# EAGLE design SuniderPra (EAGLE 9.5.2)
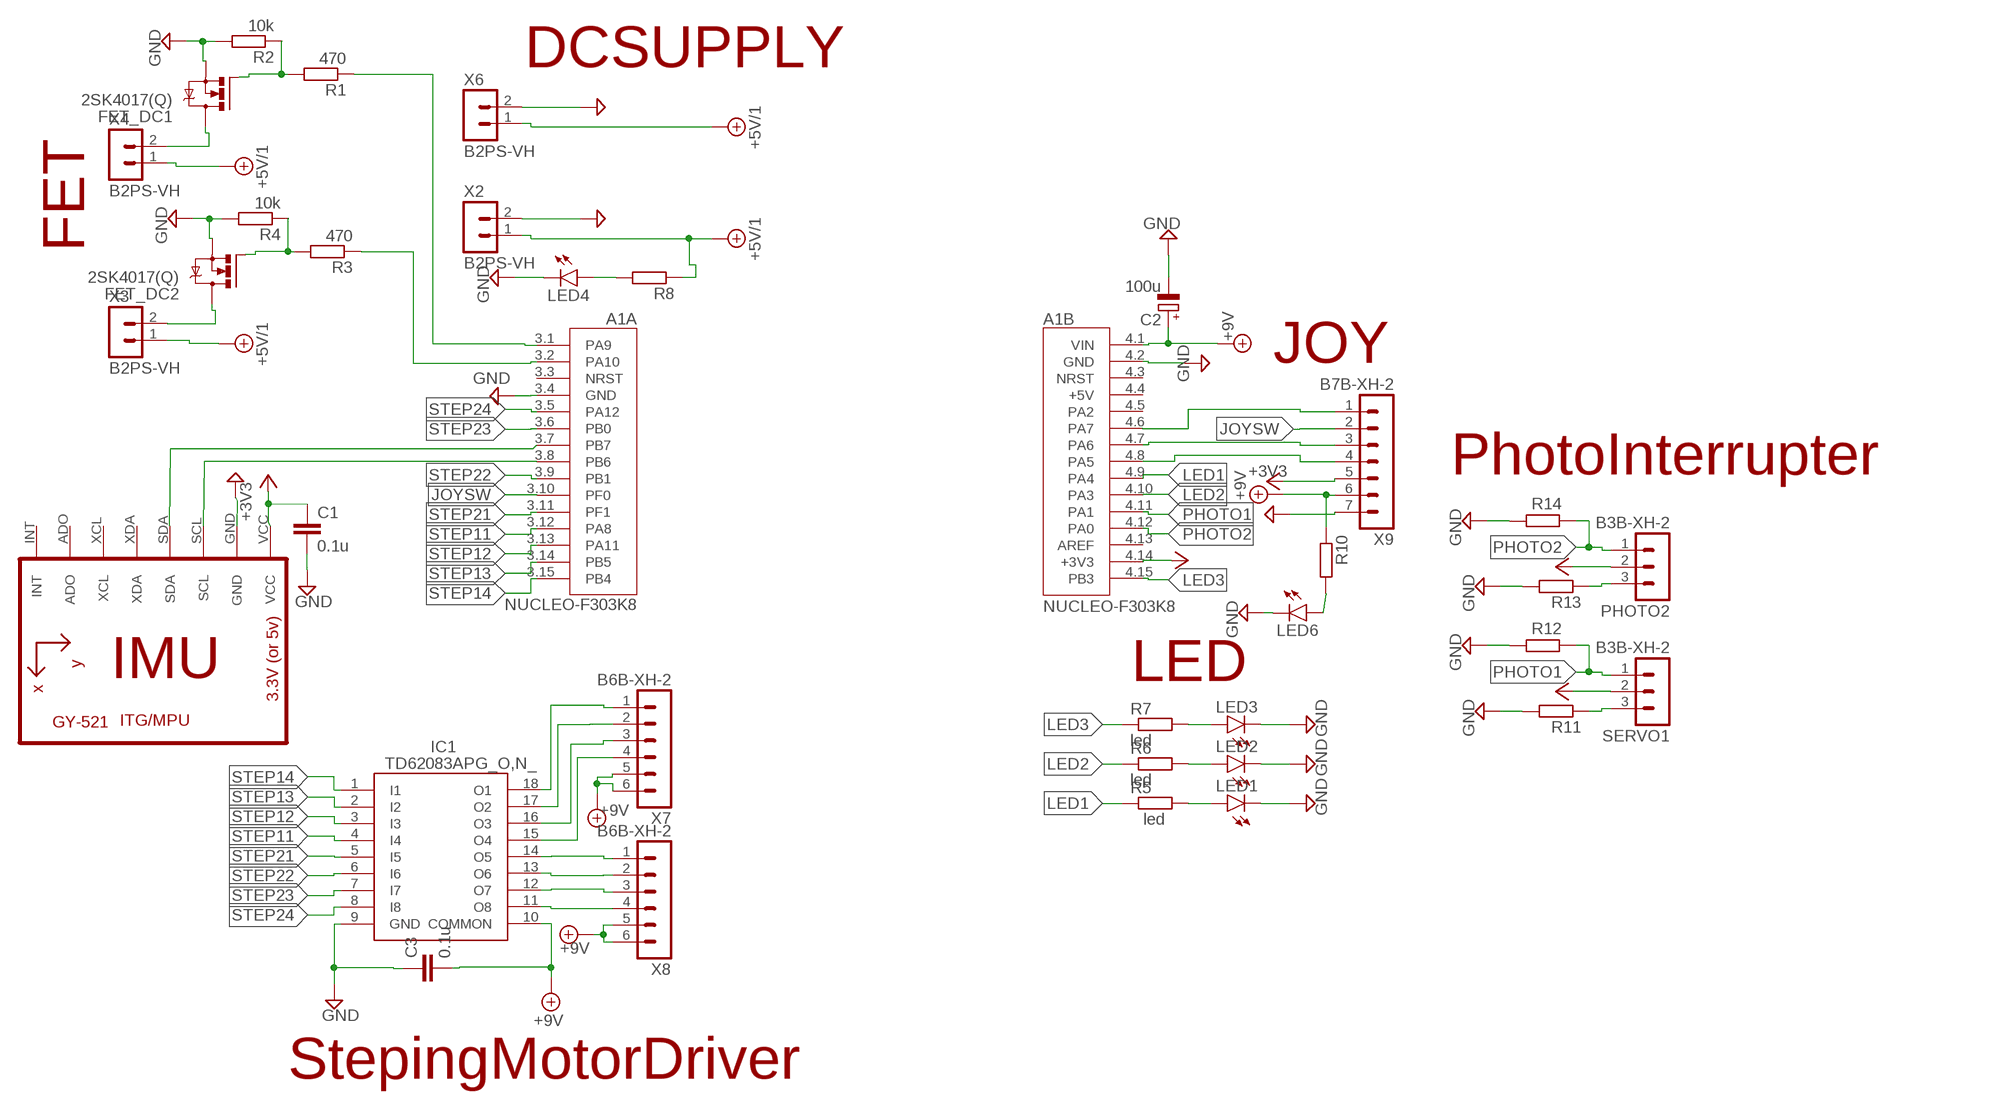
[diagram p0: schematic, sheet 1]

## Parts
A1  NUCLEO-F303K8  [MODULE_NUCLEO-F303K8]
C1  0.1u  C-EU050-024X044  [C050-024X044]
C2  100u  CPOL-EUE2,5-6E  [E2,5-6E]
C3  0.1u  C-EU050-024X044  [C050-024X044]
FET_DC1  2SK4017(Q)  [TO230P230X650X740-3P]
FET_DC2  2SK4017(Q)  [TO230P230X650X740-3P]
IC1  TD62083APG_O,N_  [DIP762W60P254L2510H445Q18N]
IMU  GY-521MPU6050  [GY-521]
LED1  LED3MM  [LED3MM]
LED2  LED3MM  [LED3MM]
LED3  LED3MM  [LED3MM]
LED4  LED3MM  [LED3MM]
LED6  LED3MM  [LED3MM]
PHOTO2  B3B-XH-2  [B3B-XH-A]
R1  470  R-EU_0207/7  [0207/7]
R2  10k  R-EU_0207/7  [0207/7]
R3  470  R-EU_0207/7  [0207/7]
R4  10k  R-EU_0207/7  [0207/7]
R5  led  R-EU_0207/7  [0207/7]
R6  led  R-EU_0207/7  [0207/7]
R7  led  R-EU_0207/7  [0207/7]
R8  led  R-EU_0207/7  [0207/7]
R10  led  R-EU_0207/7  [0207/7]
R11  220  R-EU_0207/7  [0207/7]
R12  10k  R-EU_0207/7  [0207/7]
R13  220  R-EU_0207/7  [0207/7]
R14  10k  R-EU_0207/7  [0207/7]
SERVO1  B3B-XH-2  [B3B-XH-A]
X2  B2PS-VH  [B2PS-VH]
X3  B2PS-VH  [B2PS-VH]
X4  B2PS-VH  [B2PS-VH]
X6  B2PS-VH  [B2PS-VH]
X7  B6B-XH-2  [B6B-XH-A]
X8  B6B-XH-2  [B6B-XH-A]
X9  B7B-XH-2  [B7B-XH-A]

## Nets
+3V3: A1.4.14(B:+3V3) C1.1 IMU.VCC PHOTO2.2 SERVO1.2 X9.5
+5V/1: R8.1 X2.1 X3.1 X4.1 X6.1
+9V: A1.4.1(B:VIN) C2.+ C3.2 IC1.10(COMMON) R10.1 X7.5 X7.6 X8.5 X8.6 X9.6
GND: A1.3.4(A:GND) A1.4.2(B:GND) C1.2 C2.- C3.1 FET_DC1.3(S) FET_DC2.3(S) IC1.9(GND) IMU.GND LED1.K(C) LED2.K(C) LED3.K(C) LED4.K(C) LED6.K(C) R2.2 R4.2 R11.2 R12.2 R13.2 R14.2 X2.2 X6.2 X9.7
JOYSW: A1.3.10(A:PF0) X9.2
LED1: A1.4.9(B:PA4) R5.1
LED2: A1.4.10(B:PA3) R6.1
LED3: A1.4.15(B:PB3) R7.1
N$1: A1.3.8(A:PB6) IMU.SCL
N$2: A1.3.7(A:PB7) IMU.SDA
N$3: IC1.18(O1) X7.1
N$4: IC1.12(O7) X8.3
N$5: A1.4.8(B:PA5) X9.4
N$6: FET_DC1.1(G) R1.2 R2.1
N$7: FET_DC2.2(D) X3.2
N$8: A1.3.2(A:PA10) R3.1
N$9: FET_DC2.1(G) R3.2 R4.1
N$10: FET_DC1.2(D) X4.2
N$11: LED2.A R6.2
N$12: IC1.13(O6) X8.2
N$13: A1.3.1(A:PA9) R1.1
N$14: LED1.A R5.2
N$15: LED3.A R7.2
N$16: IC1.14(O5) X8.1
N$17: IC1.15(O4) X7.4
N$18: A1.4.6(B:PA7) X9.1
N$19: A1.4.7(B:PA6) X9.3
N$21: LED4.A R8.2
N$22: IC1.16(O3) X7.3
N$23: IC1.17(O2) X7.2
N$25: LED6.A R10.2
N$26: PHOTO2.3 R13.1
N$27: R11.1 SERVO1.3
N$28: IC1.11(O8) X8.4
PHOTO1: A1.4.11(B:PA1) R12.1 SERVO1.1
PHOTO2: A1.4.12(B:PA0) PHOTO2.1 R14.1
STEP11: A1.3.12(A:PA8) IC1.4(I4)
STEP12: A1.3.13(A:PA11) IC1.3(I3)
STEP13: A1.3.14(A:PB5) IC1.2(I2)
STEP14: A1.3.15(A:PB4) IC1.1(I1)
STEP21: A1.3.11(A:PF1) IC1.5(I5)
STEP22: A1.3.9(A:PB1) IC1.6(I6)
STEP23: A1.3.6(A:PB0) IC1.7(I7)
STEP24: A1.3.5(A:PA12) IC1.8(I8)
Unconnected: A1.3.3(A:NRST) A1.4.3(B:NRST) A1.4.4(B:+5V) A1.4.5(B:PA2) A1.4.13(B:AREF) IMU.ADO IMU.INT IMU.XCL IMU.XDA

## Notes on the sheet
- DCSUPPLY
- FET
- JOY
- PhotoInterrupter
- LED
- IMU
- StepingMotorDriver

## Library data of the parts
A1 = NUCLEO-F303K8:NUCLEO-F303K8: STM32 Nucleo-32 development board with STM32F303K8T6 MCU, supports Arduino connectivity; AVAILABILITY: Unavailable; DESCRIPTION: STM32F303K8, mbed-Enabled Development Nucleo-32 STM32F3 ARM® Cortex®-M4 MCU 32-Bit Embedded Evaluation Board; MF: STMicroelectronics; MP: NUCLEO-F303K8; PACKAGE: None; PRICE: None
C1 C3 = rcl:C-EU: CAPACITOR, European symbol; SPICEPREFIX: C
C2 = rcl:CPOL-EU: POLARIZED CAPACITOR, European symbol; SPICEPREFIX: C
FET_DC1 FET_DC2 = 2SK4017_Q_:2SK4017(Q): Trans MOSFET N-CH 60V 5A 3-Pin(3+Tab) PW-Mold2 Check prices <https://pricing.snapeda.com/parts/2SK4017%28Q%29/Toshiba%20Semiconductor/view-part?ref=eda>; AVAILABILITY: Bad; DESCRIPTION: N-Channel 60V 5A (Ta) 20W (Tc) Through Hole PW-MOLD2; MF: Toshiba Semiconductor; MP: 2SK4017(Q); PACKAGE: TO-251 Toshiba; PRICE: None
IC1 = SamacSys_Parts:TD62083APG_O,N_: IC,Darlington,Sink,Driver,7ch,5V CMOS Toshiba TD62083APG(O,N) Octal NPN Darlington Transistor Array, 0.5 A 50 V HFE:1000, 18-Pin PDIP Source: Datasheet <http://docs-emea.rs-online.com/webdocs/12be/0900766b812bee23.pdf>; DESCRIPTION: IC,Darlington,Sink,Driver,7ch,5V CMOS Toshiba TD62083APG(O,N) Octal NPN Darlington Transistor Array, 0.5 A 50 V HFE:1000, 18-Pin PDIP; HEIGHT: 4.45mm; MANUFACTURER_NAME: Toshiba; MANUFACTURER_PART_NUMBER: TD62083APG(O,N); MOUSER_PART_NUMBER: 757-TD62083APGON; MOUSER_PRICE-STOCK: https://www.mouser.co.uk/ProductDetail/Toshiba/TD62083APGON?qs=tiksPeNXt0LYWQCl6bm%252B7w%3D%3D
IMU = MPU6050:GY-521
LED1-LED4 LED6 = led:LED: LED OSRAM: - CHIPLED LG R971, LG N971, LY N971, LG Q971, LY Q971, LO R971, LY R971 LH N974, LH R974 LS Q976, LO Q976, LY Q976 LO Q996 - Hyper CHIPLED LW Q18S LB Q993, LB Q99A, LB R99A - SideLED LS A670, LO A670, LY A670, LG A670, LP A670 LB A673, LV A673, LT A673, LW A673 LH A674 LY A675 LS A676, LA A676, LO A676, LY A676, LW A676 LS A679, LY A679, LG A679 - Hyper Micro SIDELED® LS Y876, LA Y876, LO Y876, LY Y876 LT Y87S - SmartLED LW L88C, LW L88S LB L89C, LB L89S, LG L890 LS L89K, LO L89K, LY L89K LS L896, LA L896, LO L896, LY L896 - TOPLED LS T670, LO T670, LY T670, LG T670, LP T670 LSG T670, LSP T670, LSY T670, LOP T670, LYG T670 LG T671, LOG T671, LSG T671 LB T673, LV T673, LT T673, LW T673 LH T674 LS T676, LA T676, LO T676, LY T676, LB T676, LH T676, LSB T676, LW T676 LB T67C, LV T67C, LT T67C, LS T67K, LO T67K, LY T67K, LW E67C LS E67B, LA E67B, LO E67B, LY E67B, LB E67C, LV E67C, LT E67C LW T67C LS T679, LY T679, LG T679 LS T770, LO T770, LY T770, LG T770, LP T770 LB T773, LV T773, LT T773, LW T773 LH T774 LS E675, LA E675, LY E675, LS T675 LS T776, LA T776, LO T776, LY T776, LB T776 LHGB T686 LT T68C, LB T68C - Hyper Mini TOPLED® LB M676 - Mini TOPLED Santana® LG M470 LS M47K, LO M47K, LY M47K Source: http://www.osram.convergy.de LUXEON: - LUMILED® LXK2-PW12-R00, LXK2-PW12-S00, LXK2-PW14-U00, LXK2-PW14-V00 LXK2-PM12-R00, LXK2-PM12-S00, LXK2-PM14-U00 LXK2-PE12-Q00, LXK2-PE12-R00, LXK2-PE12-S00, LXK2-PE14-T00, LXK2-PE14-U00 LXK2-PB12-K00, LXK2-PB12-L00, LXK2-PB12-M00, LXK2-PB14-N00, LXK2-PB14-P00, LXK2-PB14-Q00 LXK2-PR12-L00, LXK2-PR12-M00, LXK2-PR14-Q00, LXK2-PR14-R00 LXK2-PD12-Q00, LXK2-PD12-R00, LXK2-PD12-S00 LXK2-PH12-R00, LXK2-PH12-S00 LXK2-PL12-P00, LXK2-PL12-Q00, LXK2-PL12-R00 Source: www.luxeon.com KINGBRIGHT: KA-3528ASYC Source: www.kingbright.com
PHOTO2 SERVO1 = con-JST XH:B3B-XH: JST XH series header 2.50mm pitch disconnectable crimp style connectors, vertical (side entry type), 3 pins
R1-R8 R10-R14 = rcl:R-EU_: RESISTOR, European symbol; SPICEPREFIX: R
X2-X4 X6 = con-JST VH:B2PS-VH: JST VH Series header 3.96mm pitch disconnectable crimp style connectors, horizontal (side entry type), 2 pins
X7 X8 = con-JST XH:B6B-XH: JST XH series header 2.50mm pitch disconnectable crimp style connectors, vertical (side entry type), 6 pins
X9 = con-JST XH:B7B-XH: JST XH series header 2.50mm pitch disconnectable crimp style connectors, vertical (side entry type), 7 pins

## Net classes
0 default: clearance 0.508 mm

## Board
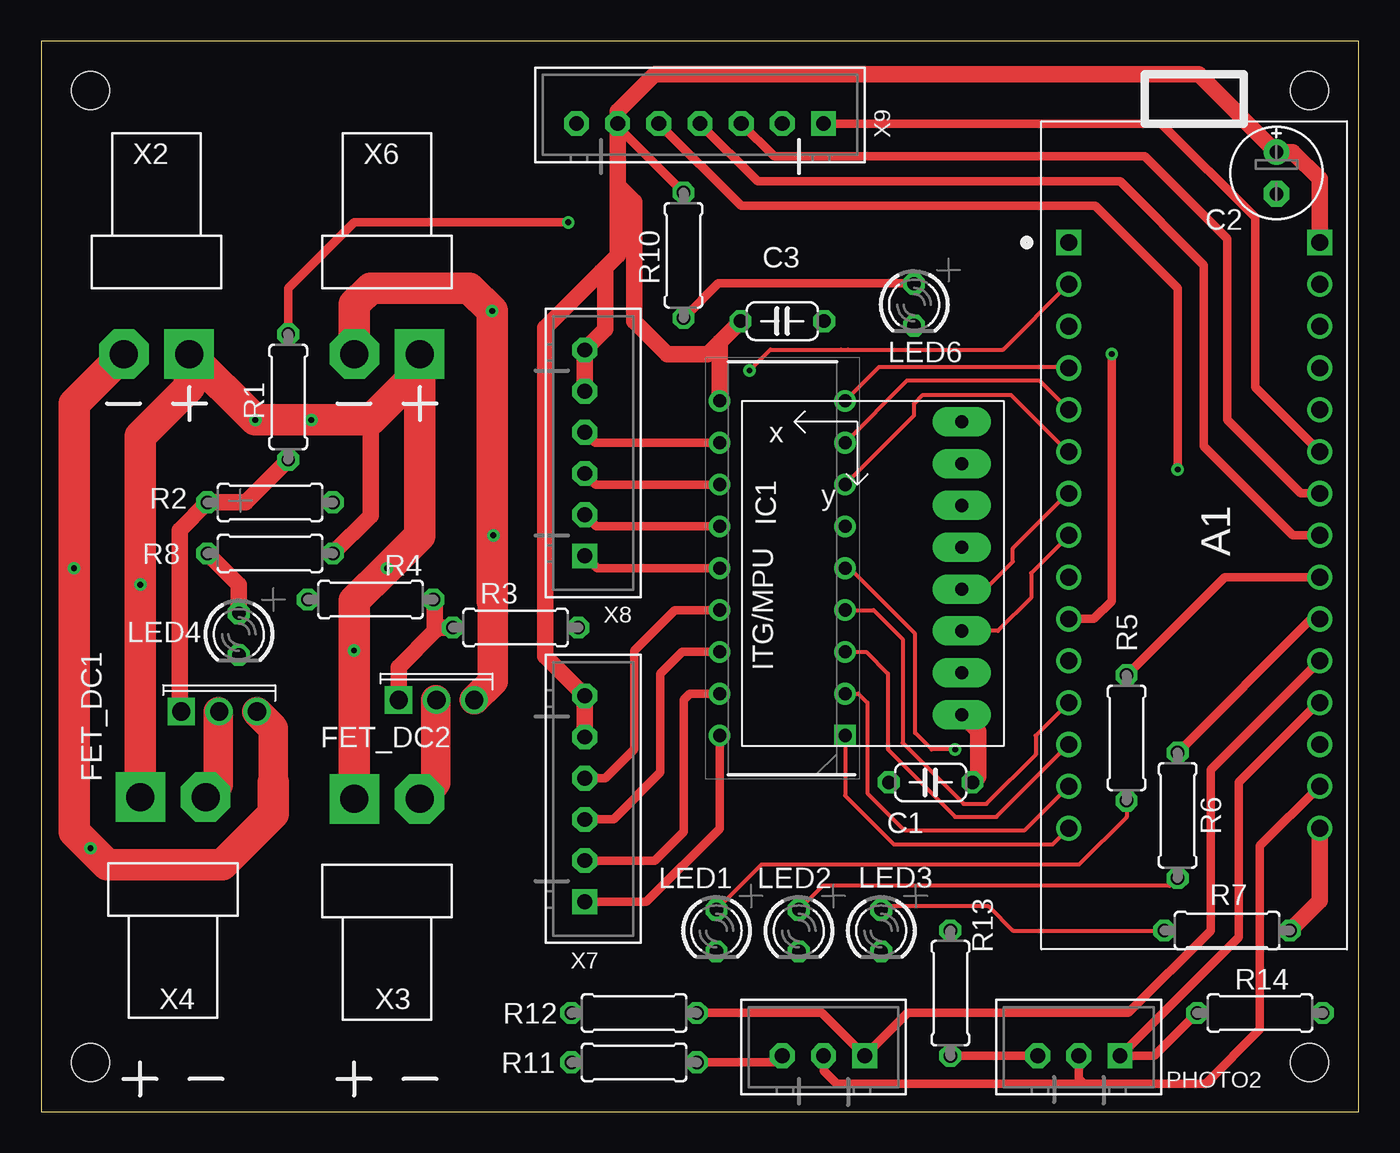
[diagram p1: board, top side]
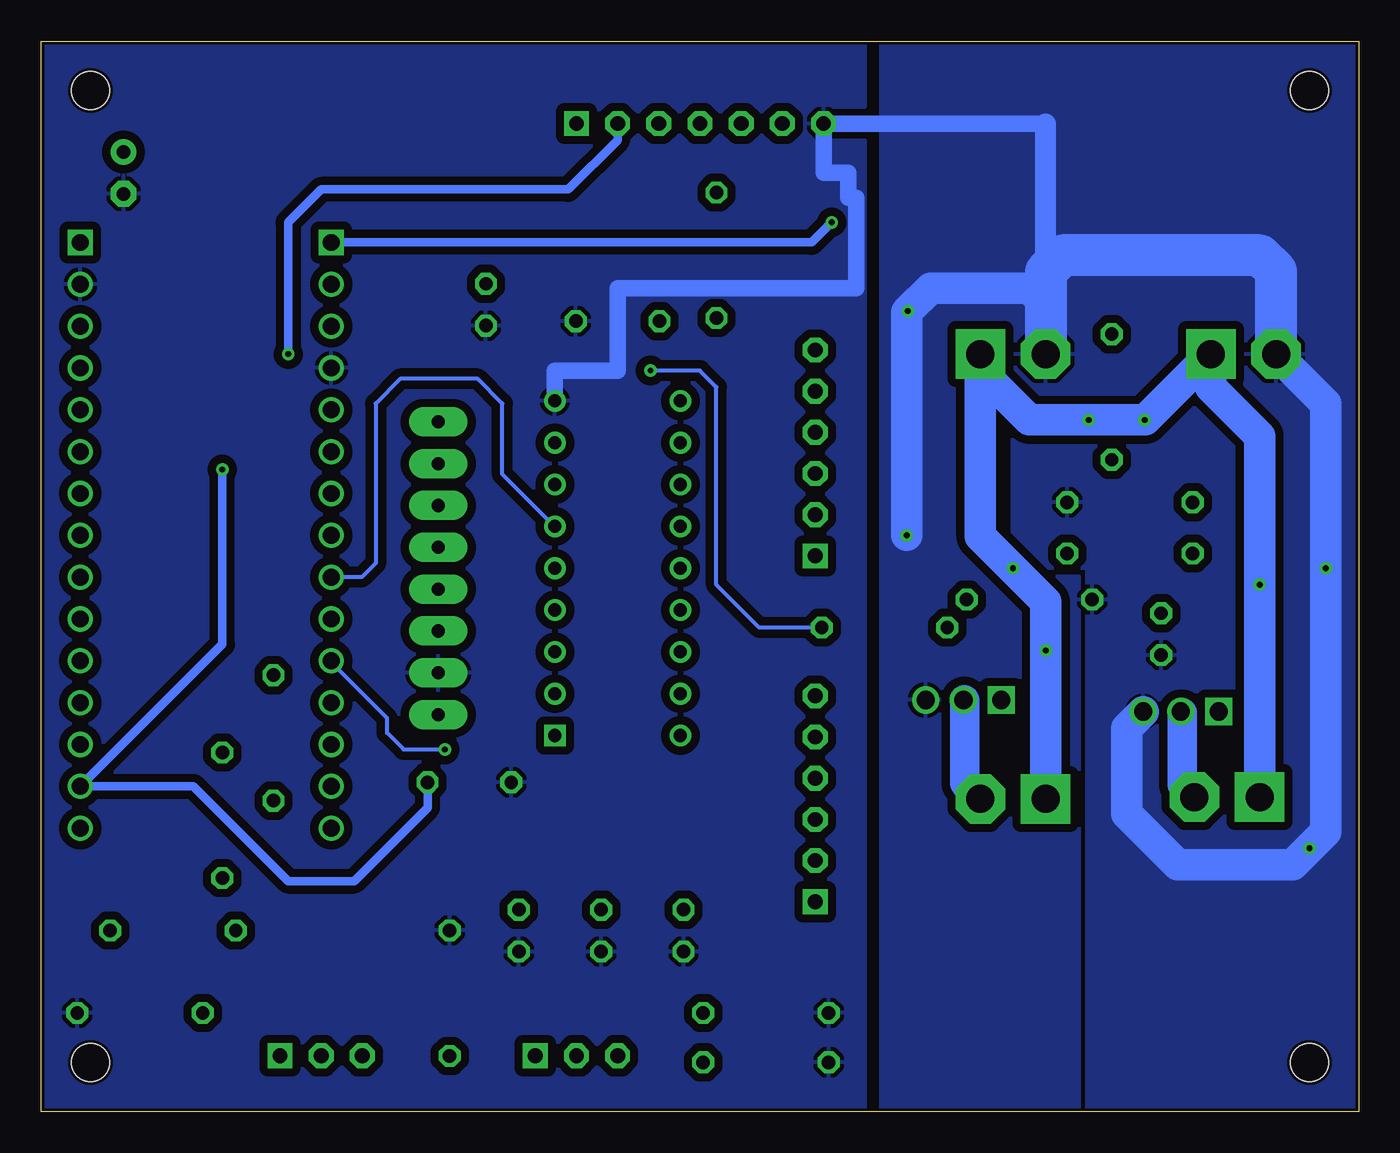
[diagram p2: board, bottom side, seen from below]

Size 80 x 65 mm. Coordinates in mm from the lower left corner, seen from the top.
Outline: 0,0 80,0 80,65 0,65 0,0
Copper layers (1*16): Top 0.035mm / dielectric 1.5mm / Bottom 0.035mm
Design rules "PCBGoGo": minimum track width 6mil, minimum drill 0.2mm, track to track 6mil, track to pad 6mil, pad to pad 6mil, via to via 6mil, smd to smd 6mil, copper to edge 0.2mm, drill to drill 6mil, minimum pad ring 10mil, minimum via ring 8mil, stop-mask expansion 4mil, vias tented up to drill 0mil, thermal gap 10mil
Holes 2.3 mm at 3,62 77,3 77,62 3,3

### Footprints (pad centres in the part's own frame; a part is rotated, then mirrored left to right if it is on the bottom)
MODULE_NUCLEO-F303K8 = drill 1.02 square: 3.1 -7.62,17.78; 4.1 7.62,17.78 | drill 1.02: 3.2 -7.62,15.24; 3.3 -7.62,12.7; 3.4 -7.62,10.16; 3.5 -7.62,7.62; 3.6 -7.62,5.08; 3.7 -7.62,2.54; 3.8 -7.62,0; 3.9 -7.62,-2.54; 3.10 -7.62,-5.08; 3.11 -7.62,-7.62; 3.12 -7.62,-10.16; 3.13 -7.62,-12.7; 3.14 -7.62,-15.24; 3.15 -7.62,-17.78; 4.2 7.62,15.24; 4.3 7.62,12.7; 4.4 7.62,10.16; 4.5 7.62,7.62; 4.6 7.62,5.08; 4.7 7.62,2.54; 4.8 7.62,0; 4.9 7.62,-2.54; 4.10 7.62,-5.08; 4.11 7.62,-7.62; 4.12 7.62,-10.16; 4.13 7.62,-12.7; 4.14 7.62,-15.24; 4.15 7.62,-17.78
C050-024X044 = drill 0.813 octagon: 1 -2.54,0; 2 2.54,0
E2,5-6E = drill 0.813 pad 1.575: + -1.27,0 | drill 0.813 pad 1.575 octagon: - 1.27,0
TO230P230X650X740-3P = drill 1.1 square: 1 0,2.3 | drill 1.1: 2 0,0; 3 0,-2.3
DIP762W60P254L2510H445Q18N = drill 0.8 pad 1.2 square: 1 -3.81,10.16 | drill 0.8 pad 1.2: 2 -3.81,7.62; 3 -3.81,5.08; 4 -3.81,2.54; 5 -3.81,0; 6 -3.81,-2.54; 7 -3.81,-5.08; 8 -3.81,-7.62; 9 -3.81,-10.16; 10 3.81,-10.16; 11 3.81,-7.62; 12 3.81,-5.08; 13 3.81,-2.54; 14 3.81,0; 15 3.81,2.54; 16 3.81,5.08; 17 3.81,7.62; 18 3.81,10.16
GY-521 = drill 0.8 pad 1.778 long: ADO -8.89,-6.35; GND -8.89,6.35; INT -8.89,-8.89; SCL -8.89,3.81; SDA -8.89,1.27; VCC -8.89,8.89; XCL -8.89,-3.81; XDA -8.89,-1.27
LED3MM = drill 0.813 octagon: A -1.27,0; K 1.27,0
B3B-XH-A = drill 0.9 pad 1.5 square: 1 2.5,0 | drill 0.9 pad 1.5 octagon: 2 0,0; 3 -2.5,0
0207/7 = drill 0.813 octagon: 1 -3.81,0; 2 3.81,0
B2PS-VH = drill 1.7 pad 3 square: 1 -1.98,0 | drill 1.7 pad 3 octagon: 2 1.98,0
B6B-XH-A = drill 0.9 pad 1.5 square: 1 6.25,0 | drill 0.9 pad 1.5 octagon: 2 3.75,0; 3 1.25,0; 4 -1.25,0; 5 -3.75,0; 6 -6.25,0
B7B-XH-A = drill 0.9 pad 1.5 square: 1 7.5,0 | drill 0.9 pad 1.5 octagon: 2 5,0; 3 2.5,0; 4 0,0; 5 -2.5,0; 6 -5,0; 7 -7.5,0

### Placement (x,y rotation side)
A1  70,35 0 top
C1  54,20 180 top
C2  75,57 270 top
C3  45,48 180 top
FET_DC1  10.8,24.3 90 top
FET_DC2  24,25 90 top
IC1  45,33 180 top
IMU  47,33 180 top
LED1  41,11 270 top
LED2  46,11 270 top
LED3  51,11 270 top
LED4  12,29 270 top
LED6  53,49 270 top
PHOTO2  63,3.4 0 top
R1  15,43.4 270 top
R2  13.9,37 0 top
R3  28.8,29.4 180 top
R4  20,31.1 180 top
R5  65.9,22.7 270 top
R6  69,18 270 top
R7  72,11 180 top
R8  13.9,33.9 180 top
R10  39,52 270 top
R11  36,3 180 top
R12  36,6 180 top
R13  55.2,7.2 90 top
R14  74,6 0 top
SERVO1  47.5,3.4 0 top
X2  7,46 180 top
X3  21,19 0 top
X4  8,19.1 0 top
X6  21,46 180 top
X7  33,19 270 top
X8  33,40 270 top
X9  40,60 0 top

### Tracks (layer width: path | path; a pad name or v marks a point on that pad's centre or on a via)
+3V3  (via drill 0.35)
  Top 0.508: SERVO1.2 47.5,2.5 48.3,1.7 63.3,1.7 | 63.3,1.7 70.7,1.7 74,5 74,16.14 A1.4.14 | PHOTO2.2 63,2 63.3,1.7 | v69,39 69,50 64,55 42.5,55 X9.5
  Top 1.016: IMU.VCC 56.89,23.11 56.89,20.35 C1.1
  Bottom 0.508: v69,39 69,28.38 A1.4.14 70.76,19.76 65,14 61,14 56.54,18.46 C1.1
+5V/1  (via drill 0.35)
  Top 1.016: R8.1 20,36.19 20,41.4 22.98,44.38 X6.1
  Top 1.9: X4.1 v6.02,32 6.02,40.98 6,41 9,44 9,45.98 X2.1 9,46 v13,42 v16.4,42 20,42 22.98,44.98 X6.1 22.98,34.98 v21,33 19.02,31.02 X3.1
  Bottom 1.9: X4.1 v6.02,32 6.02,41.02 8.98,43.98 X2.1 12.98,42 v13,42 v16.4,42 20,42 22.98,44.98 X6.1 22.98,34.94 19,30.96 v19,28 19,19.02 X3.1
+9V
  Top 0.508: R10.1 35,59.81 X9.6
  Top 1.016: C3.2 41.19,46.73 | IC1.10 41.19,46.73 | A1.4.1 77.62,56.65 76,58.27 C2.+ 70.27,63 37.25,63 35,60.75 X9.6 35,56.25 | X8.5 X8.6 34.25,47.5 34.25,51 34,51 | X7.5 X7.6 30.6,27.65 30.6,47.6 34,51 | 41.19,46.73 40.46,46 38,46 36,48 36,55.25 35,56.25 | 34,51 35,52 35,56.25
GND  (via drill 0.35)
  Top 0.254: IC1.9 50.88,45.23 62.37,45.23 62.38,45.22 A1.3.4
  Top 1.8: FET_DC1.3 14.1,23.3 14.1,20 | 27.38,31 27.38,26.08 FET_DC2.3 27.45,26.15 v27.45,35
  Top 1.9: 27.38,31 v27.38,48.62 26,50 20,50 19.02,49.02 X6.2 | X2.2 2,42.98 v2,33 2,17 v3,16 4,15 11,15 14.1,18.1 14.1,20
  Bottom 1.016: 19.02,59.98 32.48,59.98 | 32.48,59.98 X9.7 | IC1.9 48.81,45 45,45 45,50 30.5,50 30.5,55.5 31,55.5 31,57 32.48,57 32.48,59.98
  Bottom 1.27: X6.2 19.02,59.98
  Bottom 1.9: X6.2 19,46.02 19,49 20,50 26,50 v27.38,48.62 27.45,48.55 v27.45,35 | FET_DC1.3 14.1,23.3 14.1,18.1 11,15 4,15 v3,16 2,17 v2,33 2,42.98 X2.2
  Bottom 2.54: X2.2 5.02,51.02 6,52 18,52 19,51 19,46.02
  pour Bottom: 0,65 0,0 16.5,0 16.5,33 21,33 21,42 21.5,42 21.5,32.5 17,32.5 17,0 29,0 29,65
  pour Bottom: 30,65 30,61 32,61 32,59 30,59 30,0 80,0 80,65
JOYSW  (via drill 0.35)
  Top 0.508: v65,46 65,31 63.92,29.92 A1.3.10
  Bottom 0.508: v65,46 65,54 63,56 48,56 45,59 X9.2
LED1
  Top 0.508: R5.1 71.85,32.46 A1.4.9
LED2
  Top 0.508: R6.1 77.11,29.92 A1.4.10
LED3
  Top 1.016: R7.1 77.62,12.81 A1.4.15
N$1
  Top 0.254: A1.3.8 62.38,34.98 60.1,32.7 60.1,31.2 58.09,29.19 IMU.SCL
N$2
  Top 0.254: IMU.SDA 57.33,31.73 59,33.4 59,34.2 62.34,37.54 A1.3.7
N$3
  Top 0.508: X7.1 36.75,12.75 41.19,17.19 IC1.18
N$4
  Top 0.508: X8.3 33.67,38.08 IC1.12
N$5
  Top 0.508: A1.4.8 76,35 70.6,40.4 70.6,51.4 65.5,56.5 43.5,56.5 X9.4
N$6
  Top 1.016: FET_DC1.1 8.4,24.4 8.4,35.31 R2.1 12.41,37 R1.2
N$7
  Top 0.254: FET_DC2.2 23.94,25
  Top 1.8: X3.2 23.94,19.96 23.94,25
  Bottom 1.8: X3.2 23.93,19.95 23.93,24 23.93,24.93 | 23.93,24.93 23.94,24.94 23.94,25 23.93,24.99 23.93,24.93
N$8  (via drill 0.35)
  Top 0.254: A1.3.2 58.4,46.27 49,46.27 48.57,46.27 44.27,46.27 v43,45
  Bottom 0.254: R3.1 36.4,29.4 39,32 39,44 40,45 v43,45
N$9
  Top 1.016: FET_DC2.1 21.7,26.99 23.91,29.2 23.91,29.4 | 23.91,29.4 R3.2 | 23.91,29.4 23.91,31 R4.1
N$10
  Top 0.254: FET_DC1.2 10.74,24.3
  Top 1.8: X4.2 10.74,19.86 10.74,24.3
  Bottom 0.254: FET_DC1.2 10.73,24.23
  Bottom 1.8: X4.2 10.73,19.85 10.73,24.23
N$11
  Top 0.254: R6.2 68.52,13.71 47.44,13.71 LED2.A
N$12
  Top 0.508: X8.2 33.71,35.54 IC1.13
N$13  (via drill 0.35)
  Top 0.508: R1.1 15,50 19,54 v32,54
  Bottom 0.508: v32,54 33.22,52.78 A1.3.1
N$14
  Top 0.254: R5.2 65.9,17.89 63.01,15 43.73,15 LED1.A
N$15
  Top 0.254: LED3.A 51.2,12.47 57.53,12.47 59,11 R7.2
N$16
  Top 0.508: X8.1 33.75,33 IC1.14
N$17
  Top 0.508: X7.4 34.25,20.25 36,22 36,28 38.46,30.46 IC1.15
N$18
  Top 0.508: A1.4.6 73.7,44 73.7,54.3 68,60 X9.1
N$19
  Top 0.508: X9.3 44.5,58 67,58 72,53 72,42 76.46,37.54 A1.4.7
N$21
  Top 1.016: R8.2 12,31.99 LED4.A
N$22
  Top 0.508: IC1.16 38.92,27.92 37.6,26.6 37.6,20.6 34.75,17.75 X7.3
N$23
  Top 0.508: IC1.17 39.38,25.38 39,25 39,17 37.25,15.25 X7.2
N$25
  Top 0.508: R10.2 41.11,50.3 52.97,50.3 LED6.A
N$26
  Top 0.508: R13.1 PHOTO2.3
N$27
  Top 0.508: R11.1 44.6,3 SERVO1.3
N$28
  Top 0.508: X8.4 33.63,40.62 IC1.11
PHOTO1
  Top 0.508: A1.4.11 71,20.76 71,11 66,6 52.6,6 SERVO1.1 47.4,6 R12.1
PHOTO2
  Top 0.508: A1.4.12 77.54,24.84 72.7,20 72.7,10.6 PHOTO2.1 67.59,3.4 R14.1
STEP11
  Top 0.254: IC1.4 50.54,30.46 52.3,28.7 52.3,22.4 56.01,18.69 57.39,18.69 60.38,21.68 60.38,22.84 A1.3.12
STEP12
  Top 0.254: IC1.3 50.08,27.92 51.4,26.6 51.4,22 55.49,17.91 57.99,17.91 A1.3.13
STEP13
  Top 0.254: IC1.2 49.62,25.38 50.16,24.84 50.16,19.34 52.4,17.1 59.72,17.1 A1.3.14
STEP14
  Top 0.254: IC1.1 48.81,19.19 51.78,16.22 61.38,16.22 A1.3.15
STEP21  (via drill 0.35)
  Top 0.254: v55.5,22 54.06,22 53.06,23 53.06,29.02 49.08,33 IC1.5
  Bottom 0.254: A1.3.11 62.38,27.28 59,23.9 59,23 58,22 v55.5,22
STEP22
  Bottom 0.254: A1.3.9 60.54,32.46 59.7,33.3 59.7,43 58.2,44.5 53.5,44.5 52,43 52,38.7 48.84,35.54 IC1.6
STEP23
  Top 0.254: IC1.7 48.81,38.11 53,42.3 53,43 53.53,43.53 58.87,43.53 62.32,40.08 A1.3.6
STEP24
  Top 0.254: IC1.8 52.58,44.4 60.6,44.4 A1.3.5

### Text on the board
tDocu: 210315 | G | 9V | 3V | Jx | Jy | Sw | Vol | USB | 9V | 9V | G + sig | G + sig | PHOTO1